# Altium project OMODRI.PrjPcb (part 4 of 5)

## Sheet OMODRI_EtherCAT_1.SchDoc
size A4
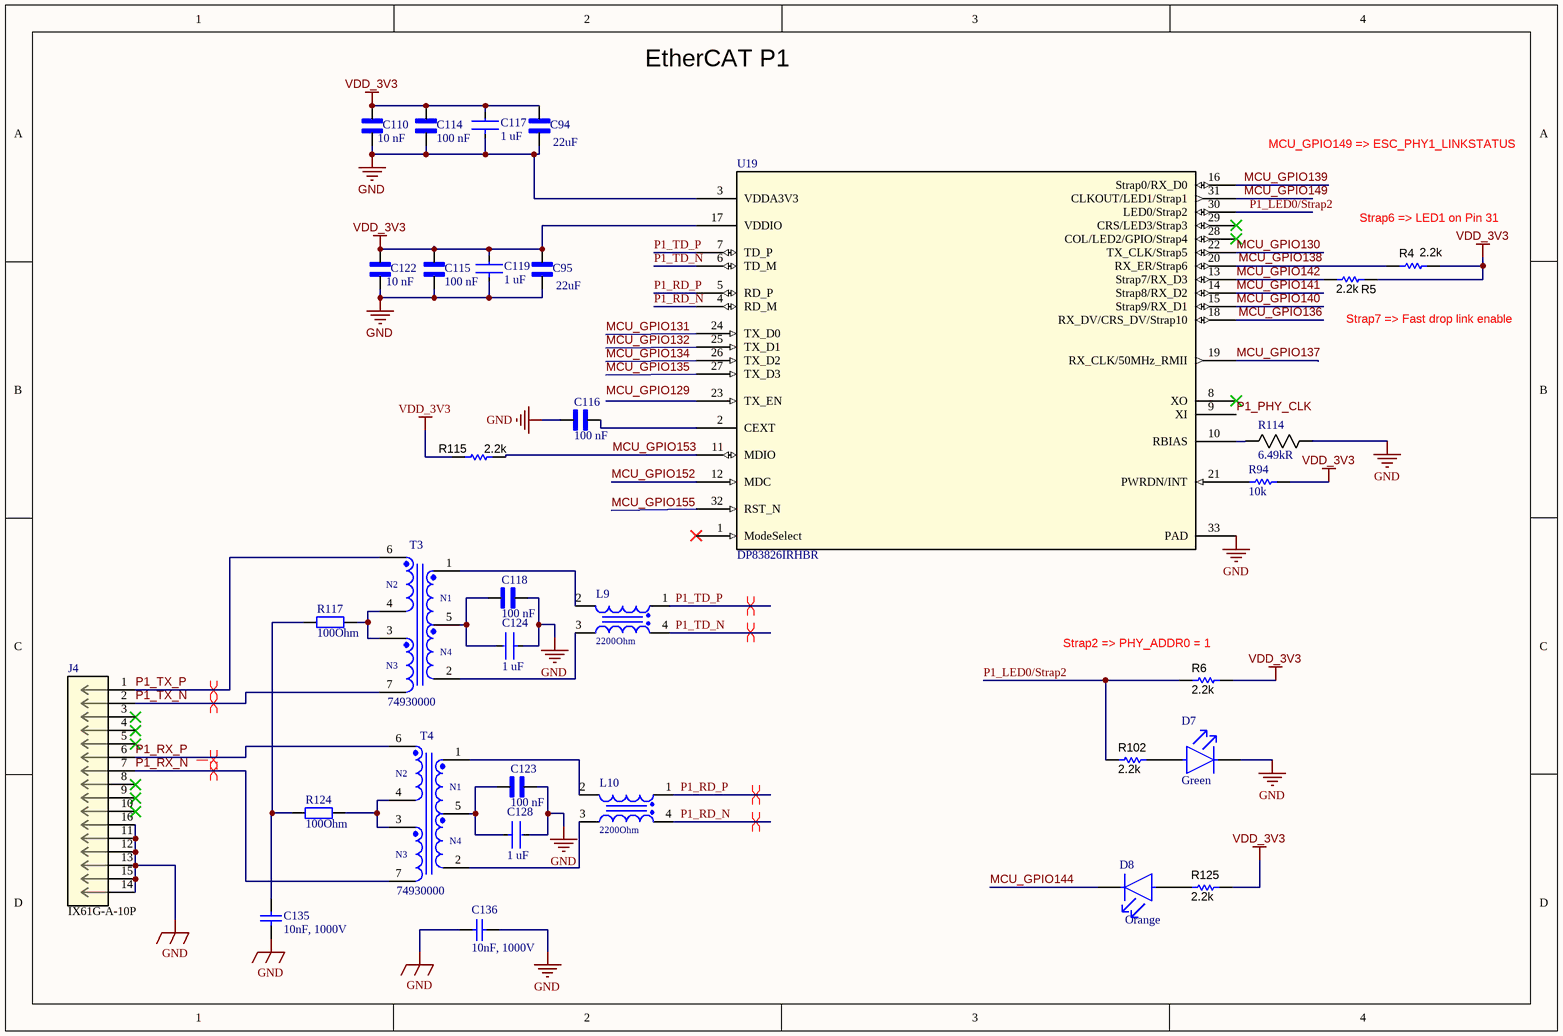
[diagram p6: OMODRI_EtherCAT_1.SchDoc]

### Parts
C94  value 22uF  [CAPC1005X55N]  (hidden comment: CL05A226MQ5N6J8)
C95  value 22uF  [CAPC1005X55N]  (hidden comment: CL05A226MQ5N6J8)
C110  value 10 nF  [CAPC0603X33N]  (hidden comment: GRM033R71E103KE14D)
C114  value 100 nF  [CAPC0603X33N]  (hidden comment: GRM033R61E104KE14D)
C115  value 100 nF  [CAPC0603X33N]  (hidden comment: GRM033R61E104KE14D)
C116  value 100 nF  [CAPC0603X33N]  (hidden comment: GRM033R61E104KE14D)
C117  value 1 uF  [FP-CC0201-BA-MFG]  (hidden comment: CC0201MRX5R5BB105)
C118  value 100 nF  [CAPC0603X33N]  (hidden comment: GRM033R61E104KE14D)
C119  value 1 uF  [FP-CC0201-BA-MFG]  (hidden comment: CC0201MRX5R5BB105)
C122  value 10 nF  [CAPC0603X33N]  (hidden comment: GRM033R71E103KE14D)
C123  value 100 nF  [CAPC0603X33N]  (hidden comment: GRM033R61E104KE14D)
C124  value 1 uF  [FP-CC0201-BA-MFG]  (hidden comment: CC0201MRX5R5BB105)
C128  value 1 uF  [FP-CC0201-BA-MFG]  (hidden comment: CC0201MRX5R5BB105)
C135  10nF, 1000V  [WCAP-CSMH_1206_H=1.25mm]
C136  10nF, 1000V  [WCAP-CSMH_1206_H=1.25mm]
D7  Illumination Color: Green  [ROHM-SML-P11MT_V]  (hidden comment: SML-P11MTT86R)
D8  Color: Orange  [ROHM-SML-P11MT_V]  (hidden comment: SML-P11DTT86R)
J4  Part Number: IX61G-A-10P  [CONN_1G-A-10P]  (value not drawn)
L9  2200Ohm  [WE-CNSW_1206]
L10  2200Ohm  [WE-CNSW_1206]
R4  ValueDisplayed: 2.2k  [0402]  (hidden comment: CRCW04022K20JNED)
R5  ValueDisplayed: 2.2k  [0402]  (hidden comment: CRCW04022K20JNED)
R6  ValueDisplayed: 2.2k  [0402]  (hidden comment: CRCW04022K20JNED)
R94  Resistance: 10k  [RESC1005X40X25LL05T05]  (hidden comment: ERJ2RKF1002X)
R102  ValueDisplayed: 2.2k  [0402]  (hidden comment: CRCW04022K20JNED)
R114  Resistance: 6.49kR  [RES_CRCW_0402]  (hidden comment: Part Number: CRCW04026K49FKED)
R115  ValueDisplayed: 2.2k  [0402]  (hidden comment: CRCW04022K20JNED)
R117  100Ohm  [WRIS-KWKB_0612_H=0.55mm]
R124  100Ohm  [WRIS-KWKB_0612_H=0.55mm]
R125  ValueDisplayed: 2.2k  [0402]  (hidden comment: CRCW04022K20JNED)
T3  74930000  [74930000]
T4  74930000  [74930000]
U19  DP83826IRHBR  [RHB0032B]

### Nets
GND: C94.1 C95.1 C110.1 C114.2 C115.2 C116.2 C117.1 C118.1 C119.1 C122.1 C123.1 C124.1 C128.2 C135.1 C136.1 C136.2 D7.1(C) J4.11 J4.12 J4.13 J4.14 J4.15 J4.16 R114.1 U19.3(VDDA3V3) U19.33(PAD)
VDD_3V3: C94.2 C95.2 C110.2 C114.1 C115.1 C117.2 C119.2 C122.2 R4.1 R5.1 R6.1 R94.1 R115.2 R125.1 U19.17(VDDIO)
MCU_GPIO130: U19.22(TX_CLK/Strap5)
MCU_GPIO131: U19.24(TX_D0)
MCU_GPIO132: U19.25(TX_D1)
MCU_GPIO134: U19.26(TX_D2)
MCU_GPIO135: U19.27(TX_D3)
MCU_GPIO136: U19.18(RX_DV/CRS_DV/Strap10)
MCU_GPIO137: U19.19(RX_CLK/50MHz_RMII)
MCU_GPIO138: R4.2 U19.20(RX_ER/Strap6)
MCU_GPIO139: U19.16(Strap0/RX_D0)
MCU_GPIO140: U19.15(Strap9/RX_D1)
MCU_GPIO141: U19.14(Strap8/RX_D2)
MCU_GPIO142: R5.2 U19.13(Strap7/RX_D3)
MCU_GPIO144: D8.1(C)
MCU_GPIO149: U19.31(CLKOUT/LED1/Strap1)
MCU_GPIO152: U19.12(MDC)
MCU_GPIO153: R115.1 U19.11(MDIO)
MCU_GPIO155: U19.32(RST_N)
P1_LED0/Strap2: R6.2 R102.1 U19.30(LED0/Strap2)
P1_PHY_CLK: U19.9(XI)
P1_RD_N: L10.4 U19.4(RD_M)
P1_RD_P: L10.1 U19.5(RD_P)
P1_RX_N: J4.7 T4.7
P1_RX_P: J4.6 T4.6
P1_TD_N: L9.4 U19.6(TD_M)
P1_TD_P: L9.1 U19.7(TD_P)
P1_TX_N: J4.2 T3.7
P1_TX_P: J4.1 T3.6
NetC116_1: C116.1 U19.2(CEXT)
NetC118_2: C118.2 C124.2 T3.5
NetC123_2: C123.2 C128.1 T4.5
NetC135_2: C135.2 R117.1 R124.1
NetD7_2: D7.2(A) R102.2
NetD8_2: D8.2(A) R125.2
NetL9_2: L9.2 T3.1
NetL9_3: L9.3 T3.2
NetL10_2: L10.2 T4.1
NetL10_3: L10.3 T4.2
NetR94_2: R94.2 U19.21(PWRDN/INT)
NetR114_2: R114.2 U19.10(RBIAS)
NetR117_2: R117.2 T3.3 T3.4
NetR124_2: R124.2 T4.3 T4.4

Not connected (* = marked no-connect by the designer): J4 3* 4* 5* 8* 9* 10*; U19 1(ModeSelect)* 8(XO)* 23(TX_EN) 28(COL/LED2/GPIO/Strap4)* 29(CRS/LED3/Strap3)*

### Layout directives
differential pair: (no net found under the mark), P1_RD_N, P1_RD_P, P1_RX_N, P1_TD_N, P1_TD_P, P1_TX_N, P1_TX_P

### Notes on the sheet
- EtherCAT P1
- MCU_GPIO149 => ESC_PHY1_LINKSTATUS
- Strap6 => LED1 on Pin 31
- Strap7 => Fast drop link enable
- (near R6) Strap2 => PHY_ADDR0 = 1
- Labels drawn without touching a wire or pin: MCU_GPIO129
- (in symbol 74930000) N2; N1; N4; N3

### Library data of the parts
C94 C95 = CL05A226MQ5N6J8: 22µF ±20% 6.3V Ceramic Capacitor X5R 0402 (1005 Metric); MF: Samsung Electro-Mechanics; Package: 0402 Samsung Electro-Mechanics; Availability: Unavailable; MP: CL05A226MQ5N6J8; DigiKey-Purchase-URL: https://snapeda.com/shop?store=DigiKey&id=3601912; SnapEDA_Link: https://www.snapeda.com/parts/CL05A226MQ5N6J8/Samsung%20Electro-Mechanics/view-part/3601912/?ref=snap; Price: None
C110 C122 = GRM033R71E103KE14D: SMD Capacitor X7R_EIA_ with Capacitance: 10000pF Tol. 10%. Rated Voltage: 25Vdc; MF: Murata; SnapEDA_Link: https://www.snapeda.com/parts/GRM033R71E103KE14D/Murata/view-part/4379447/?ref=snap; Package: 0603 Taiyo Yuden; MP: GRM033R71E103KE14D; Digi-Key_Purchase_URL: https://www.digikey.com/product-detail/en/murata-electronics/GRM033R71E103KE14D/490-14454-1-ND/6606915?utm_source=snapeda&utm_medium=aggregator&utm_campaign=symbol; Digi-Key_Part_Number: 490-14454-1-ND
C114-C116 C118 C123 = GRM033R61E104KE14D: SMD Capacitor X5R_EIA_ with Capacitance: 0.10uF Tol. 10%. Rated Voltage: 25Vdc; MF: Murata; SnapEDA_Link: https://www.snapeda.com/parts/GRM033R61E104KE14D/Murata/view-part/4375622/?ref=snap; Availability: Unavailable; MP: GRM033R61E104KE14D; Package: 0603 Taiyo Yuden; Price: None
C117 C119 C124 C128 = CMP-03422-000660-1: CAP CER 1UF 6.3V X5R 0201; Manufacturer: Yageo; Material: Ceramic; Tolerance: 0.2; Temperature Coefficient: 15%; Lead Free: Yes; Capacitance: 1 uF; ComponentLink2URL: http://www.yageo.com/documents/recent/UPY-GPHC_X5R_4V-to-50V_25.pdf; Footprint Url: http://www.yageo.com/exep/pages/download/literatures/UPY-C_GEN_24.pdf; Temperature Range Low: -55°C; Category: Cap; Device Class L3: Ceramic Capacitors; Device Class L2: Capacitors; Digikey Description: CAP CER 1UF 6.3V X5R 0201; Automotive: No; Temperature: -55°C to +85°C; RoHS: TRUE; Octopart: https://octopart.com/cc0201mrx5r5bb105-yageo-33242268; Height: 0.33mm; Temperature Range High: +85°C; Temperature Characteristic: X5R; Device Class L1: Passive Components; Package: CC0201-BA; ComponentLink2Description: Datasheet; Manufacturer Part Number: CC0201MRX5R5BB105; Voltage Rating: 6.3 V; Mouser Description: Multilayer Ceramic Capacitors MLCC - SMD/SMT 1.0uF 6.3V X5R 20%; Ipc Land Pattern Name: CAPC6030X30
C135 C136 = 885342208021: WCAP-CSMH Ceramic Capacitors, size 1206, 10nF, 1000VDC; Ceramic Type: X7R Class II; Dissipation Factor: 2.5%; Insulation Resistance: 10GOhm; Technical Reference: X7R1206103KA00DFCT10000; ComponentLink1Description: Manufacturer; ComponentLink1URL: http://www.we-online.de; ComponentLink2Description: Datasheet; ComponentLink2URL: https://katalog.we-online.com/pbs/datasheet/885342208021.pdf; Packaging: Tape and Reel; Part Number: 885342208021; Published Date: August 2019; Rated Voltage: 1000VDC; Size: 1206; Mounting Technology: SMD; Publisher: Wurth Elektronik; Capacitance: 10nF; Operating Temperature: -55 to +125degC
D7 = SML-P11MTT86R: LED Uni-Color Yellow Green 2-Pin Chip 0402(1006Metric) T/R; Manufacturer: Rohm; Lens Color: Colorless,Clear; Lens Style: Diffused,Colorless,Rectangular,Square,Clear; Number of LEDs: 1; Luminous Intensity: 2.1mcd; Forward Voltage: 1.9V; Wavelength: 569nm; Forward Current: 20mA; Test Current: 1mA; Lens Transparency: Clear; Viewing Angle: 150°; Power Rating: 54mW; Color: Green,Yellow; Supplier 1: Digi-Key; Manufacturer Part Number: SML-P11MTT86; RoHS: Yes; Category: LEDs; Stock 1: 6550; Pricing 1: 1=0,39000, 10=0,27200, 100=0,15890, 500=0,10896, 1000=0,09080, 2500=0,08172, 5000=0,07718 (USD); Mount: Surface Mount; Case/Package: 0402; Number of Pins: 2; Case Code (Imperial): 0402; Case Code (Metric): 1005; Min Operating Temperature: -40°C; Max Operating Temperature: 85°C; Packaging: Tape and Reel; Dominant Wavelength: 569nm; Package Quantity: 1; Length: 1mm; Height: 0.25mm; Width: 0.6mm; Radiation Hardening: No; REACH SVHC: No SVHC; Lead Free: Lead Free; ComponentLink1URL: https://datasheet.ciiva.com/5685/1738942-5685465.pdf?src-supplier=Farnell; ComponentLink1Description: https://datasheet.ciiva.com/5685/1738942-5685465.pdf?src-supplier=Farnell; ComponentLink2URL: https://datasheet.ciiva.com/11773/0900766b80df3ad7-11773737.pdf?src-supplier=RSComponents; ComponentLink2Description: https://datasheet.ciiva.com/11773/0900766b80df3ad7-11773737.pdf?src-supplier=RSComponents; ComponentLink3URL: https://datasheet.ciiva.com/16201/sml-p11mtt86-16201197.pdf?src-supplier=Future+Electronics; ComponentLink3Description: https://datasheet.ciiva.com/16201/sml-p11mtt86-16201197.pdf?src-supplier=Future+Electronics; ComponentLink4URL: https://datasheet.ciiva.com/2114/sml-p11-p-eco-2114983.pdf?src-supplier=Digi-Key; ComponentLink4Description: https://datasheet.ciiva.com/2114/sml-p11-p-eco-2114983.pdf?src-supplier=Digi-Key; ComponentLink5URL: https://datasheet.ciiva.com/2114/sml-p11-p-eco-2114984.pdf?src-supplier=Digi-Key; ComponentLink5Description: https://datasheet.ciiva.com/2114/sml-p11-p-eco-2114984.pdf?src-supplier=Digi-Key; ComponentLink6URL: https://datasheet.ciiva.com/2114/sml-p11-p-eco-2114985.pdf?src-supplier=Digi-Key; ComponentLink6Description: https://datasheet.ciiva.com/2114/sml-p11-p-eco-2114985.pdf?src-supplier=Digi-Key; ComponentLink7URL: https://datasheet.ciiva.com/4689/sml-p1-471200-4689502.pdf?src-supplier=Mouser; ComponentLink7Description: https://datasheet.ciiva.com/4689/sml-p1-471200-4689502.pdf?src-supplier=Mouser; ComponentLink8URL: https://datasheet.ciiva.com/29281/157928-da-01-en-led-0402-gelb-gruen-sml-p11mt-t86-29281338.pdf?src-supplier=Conrad; ComponentLink8Description: https://datasheet.ciiva.com/29281/157928-da-01-en-led-0402-gelb-gruen-sml-p11mt-t86-29281338.pdf?src-supplier=Conrad; Supplier Part Number 1: 511-1652-1-ND
D8 = SML-P11DTT86R: LED ORANGE CLEAR 1006 SMD; Manufacturer: Rohm; Lens Color: Colorless; Luminous Intensity: 7.3mcd; Test Current: 1mA; Dominant Wavelength: 605nm; Forward Voltage: 1.9V; Lens Style: Square,Diffused,Colorless; Number of LEDs: 1; Supplier 1: Digi-Key; Manufacturer Part Number: SML-P11DTT86R; RoHS: Yes; Category: LEDs; Stock 1: 2306; Pricing 1: 1=0,48000, 10=0,34300, 100=0,22400, 500=0,16100, 1000=0,12600, 2500=0,11550 (USD); Mount: Surface Mount; Case/Package: SMD/SMT; Number of Pins: 2; Lens Transparency: Clear; Forward Current: 1mA; Wavelength: 605nm; Packaging: Tape and Reel; Length: 1mm; Height: 0.25mm; Width: 0.6mm; REACH SVHC: Unknown; Lead Free: Lead Free; ComponentLink1URL: https://datasheet.ciiva.com/48679/sml-p11-p-eco-48679066.pdf?src-supplier=Avnet; ComponentLink1Description: https://datasheet.ciiva.com/48679/sml-p11-p-eco-48679066.pdf?src-supplier=Avnet; Supplier Part Number 1: SML-P11DTT86RCT-ND
J4 = IX61G-A-10P: Conn Ethernet Connector RCP 10 POS Solder RA Thru-Hole 10 Terminal 1 Port Cat 5e/Cat 6a Reel; Vendor: Hirose; Built_By: EMA_Matt; SourceLibrary: Hirose_12_20_2019; Connector Type: Receptacle; Number of Positions: 10; Manufacturer_Part_Number: IX61G-A-10P; Copyright: Copyright (C) 2018 Accelerated Designs. All rights reserved; RefDes: RefDes; Type: DEV; Value: Value; Supplier 1: Digi-Key; Manufacturer: Hirose; Manufacturer Part Number: IX61G-A-10P; RoHS: No; Category: Connectors; Stock 1: 3441; Pricing 1: 1=3,52000, 10=3,37900, 25=3,09760, 50=2,95680, 100=2,81600 (USD); Mount: Surface Mount; Contact Plating: Gold; Packaging: Tape and Reel; Termination: Solder; ComponentLink1URL: http://www.farnell.com/datasheets/2691134.pdf?src-supplier=Farnell; ComponentLink1Description: http://www.farnell.com/datasheets/2691134.pdf?src-supplier=Farnell; ComponentLink2URL: https://www.hirose.com/product/download/?distributor=digikey&amp;type=2d&amp;lang=en&amp;num=IX61G-A-10P&src-supplier=Digi-Key; ComponentLink2Description: https://www.hirose.com/product/download/?distributor=digikey&amp;type=2d&amp;lang=en&amp;num=IX61G-A-10P&src-supplier=Digi-Key; Supplier Part Number 1: H125667CT-ND
L9 L10 = 744232222: WE-CNSW SMT Common Mode Line Filter, size 1206, 2200Ohm, 0.2A, 50V; Manufacturer: Wurth Elektronik; DC Resistance max.: 1.2Ohm; Impedance Test Condition: 100MHz; Insulation Test Voltage: 125VAC; Winding Style: bifiliar; ComponentLink1Description: Manufacturer; ComponentLink1URL: http://www.we-online.de; ComponentLink2Description: Datasheet; ComponentLink2URL: https://www.we-online.com/catalog/datasheet/744232222.pdf; Operating Temperature: -40 to +125degC; Packaging: Tape and Reel; Published Date: April 2020; Rated Current: 0.2A; Size: 1206; Impedance: 2200Ohm; Manufacturer Part Number: 744232222; Rated Voltage: 50V; Mounting Technology: SMT
R4-R6 R102 R115 R125 = CMP-0026890-5: RES, 2.2 k, 5%, 0.063 W, AEC-Q200 Grade 0, 0402; Manufacturer: Vishay-Dale; Power_W: 63mW; TempCo: 200 ppm/C; Value_Code: 2k20; Value: 2.2k; EIA_Code: E24; SizeX_mm: 1; SizeY_mm: 0.5; SizeZ_mm: 0.6; Value2: 0.063W; AEC Qualified: Y; VDC_V: 50V; AEC Category: Q200; AEC Grade: 0; Supplier Part Number 2: 59M6710; Supplier 2: Newark; Supplier Part Number 3: 71-CRCW0402J-2.2K-E3; Supplier 3: Mouser; RoHS: E; Value1: 5%; MountType: SMT; Supplier 1: Digi-Key; PackageReference: 0402; Tolerance_%: 5%; Res_ohm: 2.2k; SizeArea_mm2: 0.5; CompType: Resistor; PartNumber: CRCW04022K20JNED; ComponentLink1Description: Datasheet link; Supplier Part Number 1: 541-2.2KJCT-ND; Technology: Thick Film; ComponentLink1URL: http://www.vishay.com/docs/20035/dcrcwe3.pdf
R94 = CMP-2000-07588-1: Chip Resistor, 10 KOhm, +/- 1%, 0.1 W, -55 to 155 degC, 0402 (1005 Metric), RoHS, Tape and Reel; Manufacturer: Panasonic; Power Rating: 100mW; Voltage Rating: 50V; Case\/Package: 0402; Temperature Coefficient: 100ppm\/degreesC; RoHSCompliant: True; Lead Free: LeadFree; Package Quantity: 1; Contact Plating: Tin; Length: 1mm; Radiation Hardening: No; REACH SVHC: NoSVHC; Max Operating Temperature: 155degC; Depth: 0.5mm; Case Code (Imperial): 0402; Military Standard: Not; Package Description: 2-Pin Surface Mount Device, Body 1 x 0.5 mm; Termination: SMD/SMT; Case Code (Metric): 1005; Height: 0.35mm; Packaging: TapeandReel; Voltage Rating (DC): 50V; Package Reference: 402; Number of Pins: 2; Tolerance: 1%; Mounting Technology: SurfaceMount; Width: 0.02inch; Mount: SurfaceMount; Datasheet URL: https://industrial.panasonic.com/cdbs/www-data/pdf/RDA0000/AOA0000C304.pdf; Composition: ThickFilm; Datasheet Version: 02/2017; Manufacturer URL: http://www.panasonic.com/; Max Power Dissipation: 100mW; Number of Terminations: 2; Min Operating Temperature: -55degC
R114 = CRCW04026K49FKED: Res Thick Film 0402 6.49K Ohm 1% 0.063W(1/16W) ±100ppm/C Pad SMD Automotive T/R; Vendor: Vishay; Built_By: EMA_UL_Team; Temperature Coefficient: 100ppm/°C; Power Rating: 63mW; Voltage Rating: 50V; Manufacturer_Part_Number: CRCW04026K49FKED; Copyright: Copyright (C) 2018 Accelerated Designs. All rights reserved; RefDes: RefDes; Type: DEV; Value: Value; Supplier 1: Digi-Key; Manufacturer: Vishay; Manufacturer Part Number: CRCW04026K49FKED; RoHS: Yes; Category: Chip SMD Resistors; Stock 1: 24052; Pricing 1: 1=0,10000, 10=0,03600, 100=0,01460, 1000=0,00657, 2500=0,00570, 5000=0,00471 (USD); Mount: Surface Mount; Case/Package: 0402; Number of Pins: 2; Weight: 2.3E-05oz; Contact Plating: Tin; Case Code (Metric): 1005; Case Code (Imperial): 0402; Min Operating Temperature: -55°C; Max Operating Temperature: 155°C; Composition: Thick Film; Packaging: Tape and Reel; Package Quantity: 10; Number of Terminations: 2; Max Power Dissipation: 63mW; Voltage Rating (DC): 50V; Military Standard: Not; Termination: SMD/SMT; Features: Automotive AEC-Q200; Length: 1mm; Height: 0.35mm; Width: 0.02inch; Depth: 0.5mm; Radiation Hardening: No; Lead Free: Lead Free; REACH SVHC: Unknown; ComponentLink1URL: https://datasheet.ciiva.com/11818/0900766b80d98824-11818134.pdf?src-supplier=RSComponents; ComponentLink1Description: https://datasheet.ciiva.com/11818/0900766b80d98824-11818134.pdf?src-supplier=RSComponents; ComponentLink2URL: https://datasheet.ciiva.com/2463/dcrcwe3-2463233.pdf?src-supplier=Digi-Key; ComponentLink2Description: https://datasheet.ciiva.com/2463/dcrcwe3-2463233.pdf?src-supplier=Digi-Key; ComponentLink3URL: https://datasheet.ciiva.com/2463/dcrcwe3-2463234.pdf?src-supplier=Digi-Key; ComponentLink3Description: https://datasheet.ciiva.com/2463/dcrcwe3-2463234.pdf?src-supplier=Digi-Key; ComponentLink4URL: https://datasheet.ciiva.com/5551/dcrcwe3-109170-5551783.pdf?src-supplier=Mouser; ComponentLink4Description: https://datasheet.ciiva.com/5551/dcrcwe3-109170-5551783.pdf?src-supplier=Mouser; ComponentLink5URL: https://datasheet.ciiva.com/7679/1697337-7679082.pdf?src-supplier=Element14; ComponentLink5Description: https://datasheet.ciiva.com/7679/1697337-7679082.pdf?src-supplier=Element14; ComponentLink6URL: https://datasheet.ciiva.com/7679/1697337-7679258.pdf?src-supplier=Element14; ComponentLink6Description: https://datasheet.ciiva.com/7679/1697337-7679258.pdf?src-supplier=Element14; ComponentLink7URL: https://datasheet.ciiva.com/2463/dcrcwe3-2463232.pdf?src-supplier=Digi-Key; ComponentLink7Description: https://datasheet.ciiva.com/2463/dcrcwe3-2463232.pdf?src-supplier=Digi-Key; Supplier Part Number 1: 541-6.49KLCT-ND; Tolerance: 1%
R117 R124 = 561020132009: WRIS-KWKB Thick Film Resistors, size 0612, 100Ohm, +/-5%, 0.75W; Rated Current: 86.6mA; Temperature Coefficient of Resistance: +/-200ppm/degC; Technical Reference: KB06121000J304DAATP0000; ComponentLink1Description: Manufacturer; ComponentLink1URL: http://www.we-online.de; ComponentLink2Description: Datasheet; ComponentLink2URL: https://katalog.we-online.com/pbs/datasheet/561020132009.pdf; Publisher: Wurth Elektronik; Rated Power: 0.75W; Resistance: 100Ohm; Mounting Technology: SMT; Height: 0.55mm; Part Number: 561020132009; Packaging: Tape and Reel; Published Date: September 2019; Size: 0612; Length: 1.6mm; Operating Temperature: -55 to +155degC; Resistance Tolerance: +/-5%; Width: 3.2mm
T3 T4 = 74930000: WE-STST Super Tiny Signal Transformer, size 4532, 350uH; Insulation Test Voltage: 1500VRMS; Turns Ratio: 1:1; ComponentLink1Description: Manufacturer; ComponentLink1URL: http://www.we-online.de; ComponentLink2Description: Datasheet; ComponentLink2URL: https://katalog.we-online.com/pbs/datasheet/74930000.pdf; Packaging: Tape and Reel; Publisher: Wurth Elektronik; Size: 4532; Inductance: 350uH; Mounting Technology: SMT; Operating Temperature: -40 to +105degC; Part Number: 74930000; Published Date: November 2019
U19 = DP83826IRHBR: Low latency 10/100-Mbps PHY, MII interface and enhanced mode with an industrial temperature range 32-VQFN -40 to 85; Manufacturer: Texas Instruments; Supplier 1: Avnet; Manufacturer Part Number: DP83826IRHBR; Pricing 1: 3000=1,00750, 6000=0,96850, 12000=0,92300, 18000=0,89700, 24000=0,86450 (USD); ComponentLink1URL: https://octopart.com/click/track?ai=8629&ct=datasheets&sig=00cfb32&at=physicalpart&sid=370&ppid=108112645&hlid=29178382&src-supplier=TI+store; ComponentLink1Description: https://octopart.com/click/track?ai=8629&ct=datasheets&sig=00cfb32&at=physicalpart&sid=370&ppid=108112645&hlid=29178382&src-supplier=TI+store; Supplier Part Number 1: DP83826IRHBR

## Sheet OMODRI_Power.SchDoc
size A3; Date: Not shown in title block; ApprovedBy: Not shown in title block; CheckedBy: Not shown in title block; Author: Not shown in title block; CompanyName: Not shown in title block; DrawnBy: Cody Watkins; Engineer: Not shown in title block; Organization: Not shown in title block; Address1: Not shown in title block; Address2: Not shown in title block; Address3: Not shown in title block; Address4: Not shown in title block; DocumentNumber: 5; Revision: Use project parameter SCH_Rev; SheetNumber: 5; SheetTotal: 11; PageSetup: Record=PageOptions|CenterHorizontal=True|CenterVertical=True|PrintScale=1.00|XCorrection=1.00|YCorrection=1.00|PrintKind=0|BorderSize=5000000|LeftOffset=0|BottomOffset=0|Orientation=2|PaperLength=1000|PaperWidth=1000|Scale=100|PaperSource=15|PrintQuality=600|MediaType=1|DitherType=10|PaperKind=Letter|PrintScaleMode=1; CurrentTime: Not shown in title block; CurrentDate: Not shown in title block; Time: Not shown in title block; DocumentFullPathAndName: Not shown in title block; DocumentName: Not shown in title block; ModifiedDate: Not shown in title block; ImagePath: Not shown in title block
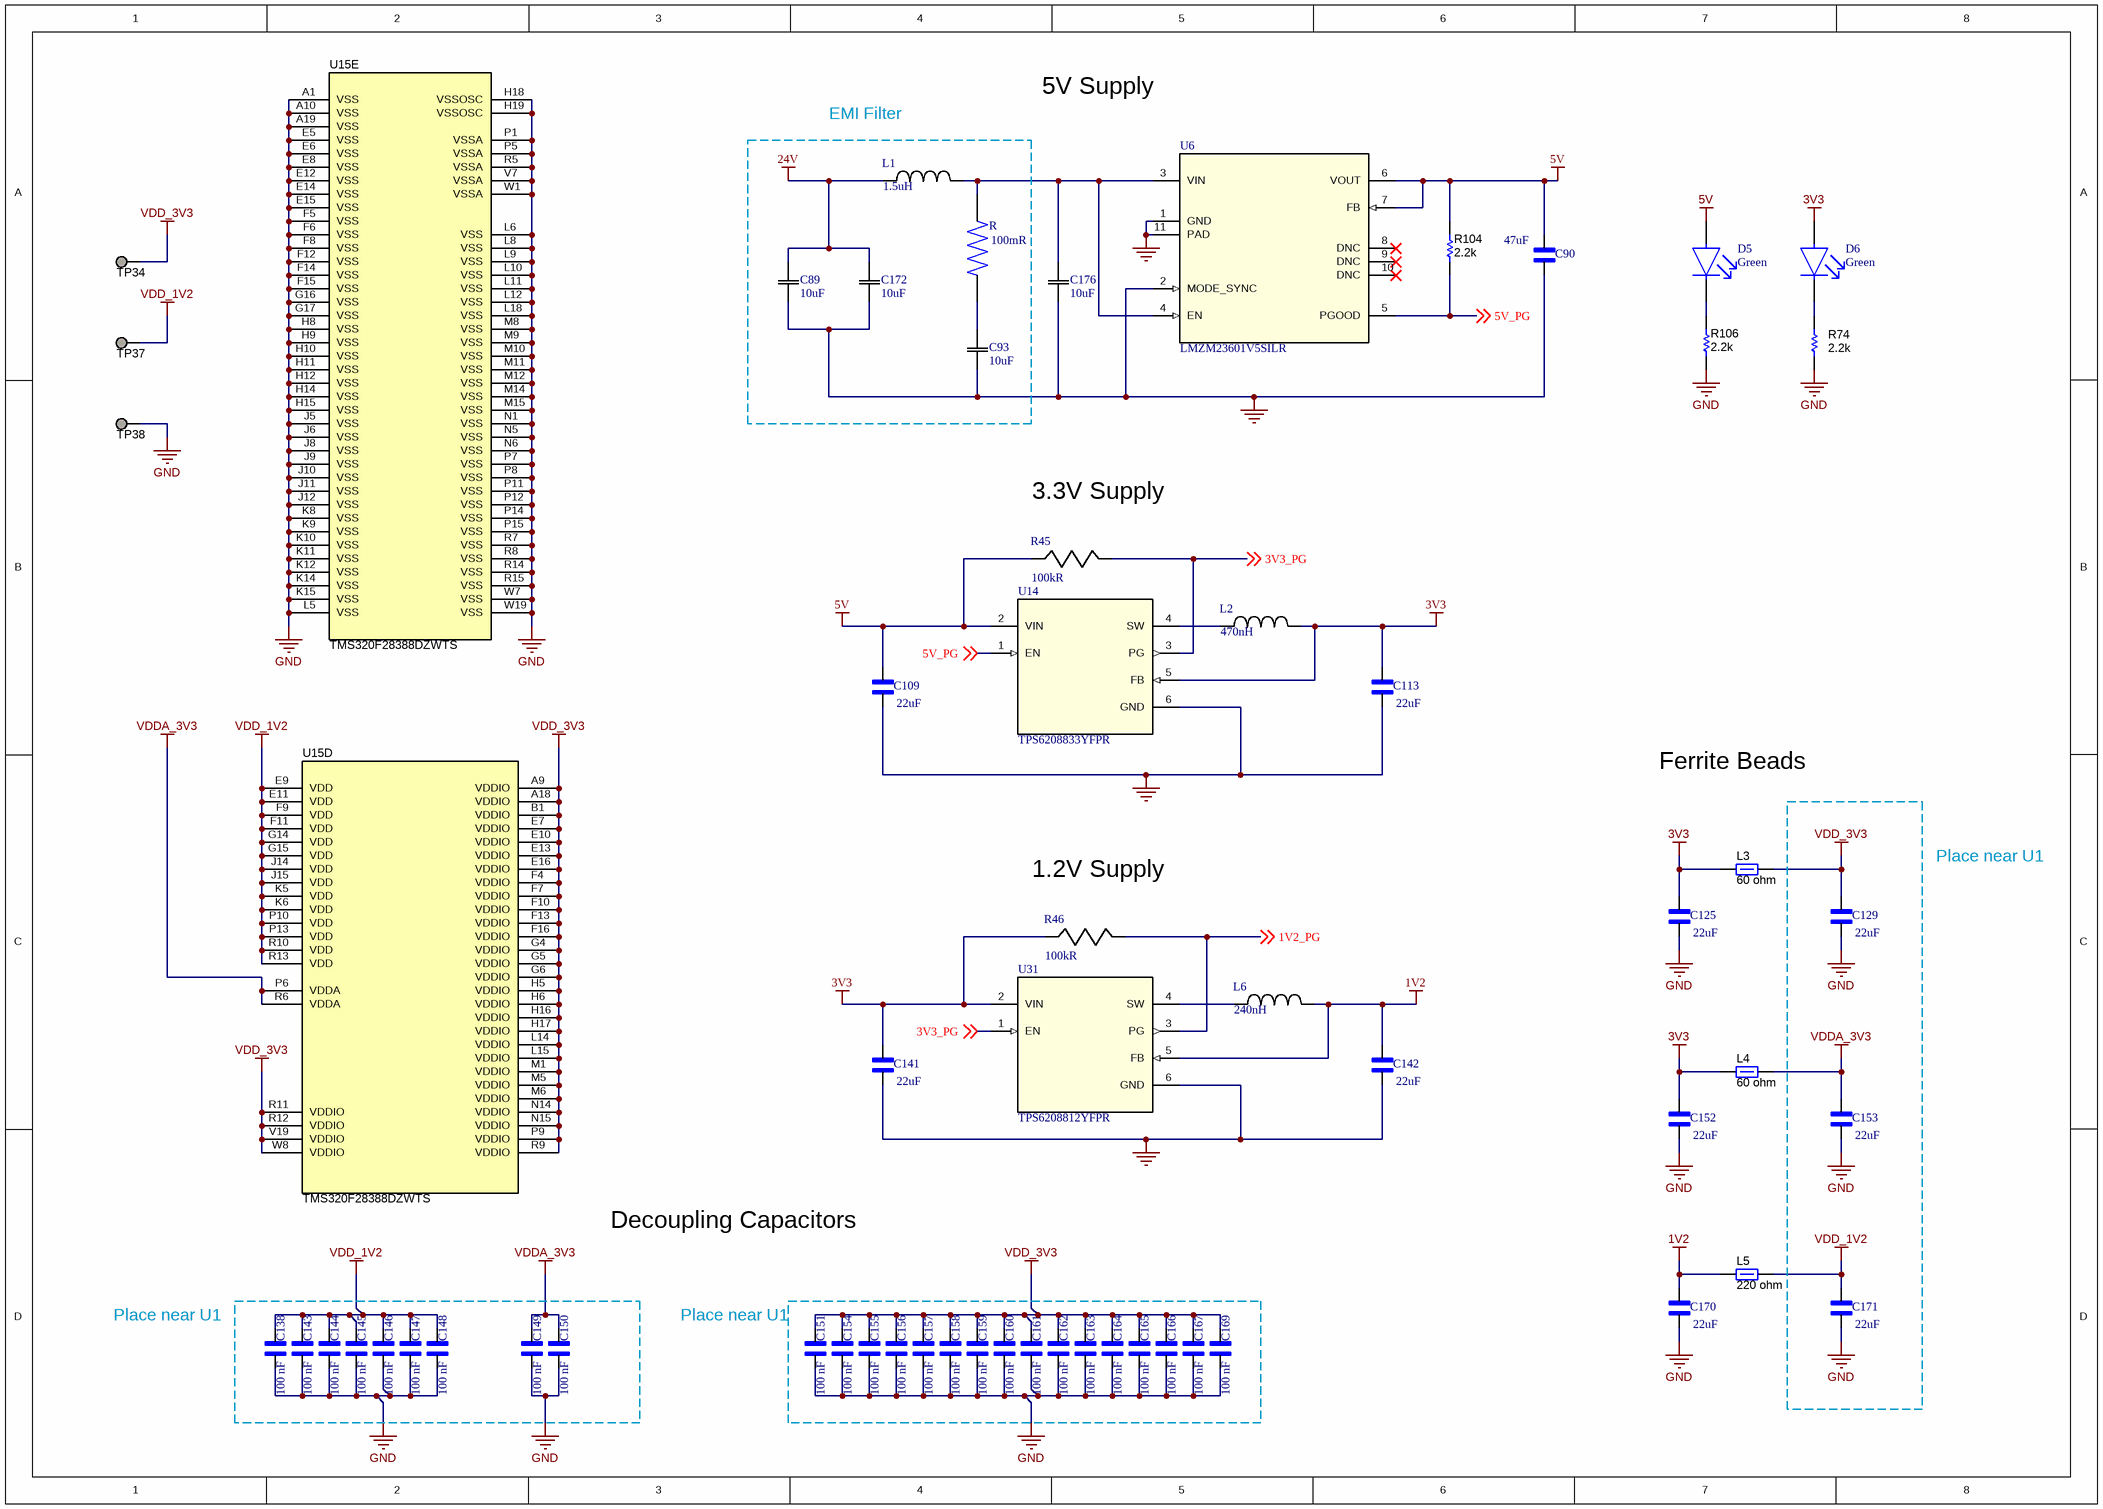
[diagram p7: OMODRI_Power.SchDoc]

### Parts
C89  Capacitance: 10uF  [CAP_CL10]  (hidden comment: Part Number: CL10A106MA8NRNC)
C90  value 47uF  [CAPC2012X145N]  (hidden comment: C2012X5R1A476M125AC)
C93  Capacitance: 10uF  [CAP_CL10]  (hidden comment: Part Number: CL10A106MA8NRNC)
C109  value 22uF  [CAPC1005X55N]  (hidden comment: CL05A226MQ5N6J8)
C113  value 22uF  [CAPC1005X55N]  (hidden comment: CL05A226MQ5N6J8)
C125  value 22uF  [CAPC1005X55N]  (hidden comment: CL05A226MQ5N6J8)
C129  value 22uF  [CAPC1005X55N]  (hidden comment: CL05A226MQ5N6J8)
C138  value 100 nF  [CAPC0603X33N]  (hidden comment: GRM033R61E104KE14D)
C141  value 22uF  [CAPC1005X55N]  (hidden comment: CL05A226MQ5N6J8)
C142  value 22uF  [CAPC1005X55N]  (hidden comment: CL05A226MQ5N6J8)
C143  value 100 nF  [CAPC0603X33N]  (hidden comment: GRM033R61E104KE14D)
C144  value 100 nF  [CAPC0603X33N]  (hidden comment: GRM033R61E104KE14D)
C145  value 100 nF  [CAPC0603X33N]  (hidden comment: GRM033R61E104KE14D)
C146  value 100 nF  [CAPC0603X33N]  (hidden comment: GRM033R61E104KE14D)
C147  value 100 nF  [CAPC0603X33N]  (hidden comment: GRM033R61E104KE14D)
C148  value 100 nF  [CAPC0603X33N]  (hidden comment: GRM033R61E104KE14D)
C149  value 100 nF  [CAPC0603X33N]  (hidden comment: GRM033R61E104KE14D)
C150  value 100 nF  [CAPC0603X33N]  (hidden comment: GRM033R61E104KE14D)
C151  value 100 nF  [CAPC0603X33N]  (hidden comment: GRM033R61E104KE14D)
C152  value 22uF  [CAPC1005X55N]  (hidden comment: CL05A226MQ5N6J8)
C153  value 22uF  [CAPC1005X55N]  (hidden comment: CL05A226MQ5N6J8)
C154  value 100 nF  [CAPC0603X33N]  (hidden comment: GRM033R61E104KE14D)
C155  value 100 nF  [CAPC0603X33N]  (hidden comment: GRM033R61E104KE14D)
C156  value 100 nF  [CAPC0603X33N]  (hidden comment: GRM033R61E104KE14D)
C157  value 100 nF  [CAPC0603X33N]  (hidden comment: GRM033R61E104KE14D)
C158  value 100 nF  [CAPC0603X33N]  (hidden comment: GRM033R61E104KE14D)
C159  value 100 nF  [CAPC0603X33N]  (hidden comment: GRM033R61E104KE14D)
C160  value 100 nF  [CAPC0603X33N]  (hidden comment: GRM033R61E104KE14D)
C161  value 100 nF  [CAPC0603X33N]  (hidden comment: GRM033R61E104KE14D)
C162  value 100 nF  [CAPC0603X33N]  (hidden comment: GRM033R61E104KE14D)
C163  value 100 nF  [CAPC0603X33N]  (hidden comment: GRM033R61E104KE14D)
C164  value 100 nF  [CAPC0603X33N]  (hidden comment: GRM033R61E104KE14D)
C165  value 100 nF  [CAPC0603X33N]  (hidden comment: GRM033R61E104KE14D)
C166  value 100 nF  [CAPC0603X33N]  (hidden comment: GRM033R61E104KE14D)
C167  value 100 nF  [CAPC0603X33N]  (hidden comment: GRM033R61E104KE14D)
C169  value 100 nF  [CAPC0603X33N]  (hidden comment: GRM033R61E104KE14D)
C170  value 22uF  [CAPC1005X55N]  (hidden comment: CL05A226MQ5N6J8)
C171  value 22uF  [CAPC1005X55N]  (hidden comment: CL05A226MQ5N6J8)
C172  Capacitance: 10uF  [CAP_CL10]  (hidden comment: Part Number: CL10A106MA8NRNC)
C176  Capacitance: 10uF  [CAP_CL10]  (hidden comment: Part Number: CL10A106MA8NRNC)
D5  Illumination Color: Green  [ROHM-SML-P11MT_V]  (hidden comment: SML-P11MTT86R)
D6  Illumination Color: Green  [ROHM-SML-P11MT_V]  (hidden comment: SML-P11MTT86R)
L1  Inductance: 1.5uH  [0805]  (hidden comment: LQM21PN1R5MC0D)
L2  Inductance: 470nH  [0603]  (hidden comment: DFE18SANR47MG0L)
L3  value 60 ohm  [0805_HV]  (hidden comment: BKP2125HS600-T)
L4  value 60 ohm  [0805_HV]  (hidden comment: BKP2125HS600-T)
L5  value 220 ohm  [0805_HV]  (hidden comment: BLM21PG221SN1D)
L6  Inductance: 240nH  [DFE18_E]  (hidden comment: DFE18SANR24ME0L)
R  value 100mR  [RESC0603X29N]  (hidden comment: UCR006YVPFLR100)
R45  Resistance: 100kR  [0402]  (hidden comment: CRCW0402100KFKED)
R46  Resistance: 100kR  [0402]  (hidden comment: CRCW0402100KFKED)
R74  ValueDisplayed: 2.2k  [0402]  (hidden comment: CRCW04022K20JNED)
R104  ValueDisplayed: 2.2k  [0402]  (hidden comment: CRCW04022K20JNED)
R106  ValueDisplayed: 2.2k  [0402]  (hidden comment: CRCW04022K20JNED)
TP34  TESTPOINT  [TP_50MIL-25MILHOLE]  (value not drawn)  (no BOM)
TP37  TESTPOINT  [TP_50MIL-25MILHOLE]  (value not drawn)  (no BOM)
TP38  TESTPOINT  [TP_50MIL-25MILHOLE]  (value not drawn)  (no BOM)
U6  LMZM23601V5SILR  [SIL0010A]
U14  TPS6208833YFPR  [YFP0006AAAA]
U15  TMS320F28388DZWTS  [ZWT0337A]  (parts D,E of 5)
U31  TPS6208812YFPR  [YFP0006AAAA]

### Nets
0: C89.1 C90.1 C93.1 C109.1 C113.1 C141.1 C142.1 C172.1 C176.1 U6.1(GND) U6.2(MODE_SYNC) U6.11(PAD) U14.6(GND) U31.6(GND)
1V2: C142.2 C170.2 L5.1 L6.1 U31.5(FB)
3V3: C113.2 C125.2 C141.2 C152.2 D6.2(A) L2.1 L3.1 L4.1 R46.2 U14.5(FB) U31.2(VIN)
5V: C90.2 C109.2 D5.2(A) R45.2 R104.1 U6.6(VOUT) U6.7(FB) U14.2(VIN)
24V: C89.2 C172.2 L1.1
GND: C125.1 C129.1 C138.2 C143.2 C144.2 C145.2 C146.2 C147.2 C148.2 C149.2 C150.2 C151.2 C152.1 C153.1 C154.2 C155.2 C156.2 C157.2 C158.2 C159.2 C160.2 C161.2 C162.2 C163.2 C164.2 C165.2 C166.2 C167.2 C169.2 C170.1 C171.1 R74.1 R106.2 TP38.1 U15.A1(VSS) U15.A10(VSS) U15.A19(VSS) U15.E5(VSS) U15.E6(VSS) U15.E8(VSS) U15.E12(VSS) U15.E14(VSS) U15.E15(VSS) U15.F5(VSS) U15.F6(VSS) U15.F8(VSS) U15.F12(VSS) U15.F14(VSS) U15.F15(VSS) U15.G16(VSS) U15.G17(VSS) U15.H8(VSS) U15.H9(VSS) U15.H10(VSS) U15.H11(VSS) U15.H12(VSS) U15.H14(VSS) U15.H15(VSS) U15.H18(VSSOSC) U15.H19(VSSOSC) U15.J5(VSS) U15.J6(VSS) U15.J8(VSS) U15.J9(VSS) U15.J10(VSS) U15.J11(VSS) U15.J12(VSS) U15.K8(VSS) U15.K9(VSS) U15.K10(VSS) U15.K11(VSS) U15.K12(VSS) U15.K14(VSS) U15.K15(VSS) U15.L5(VSS) U15.L6(VSS) U15.L8(VSS) U15.L9(VSS) U15.L10(VSS) U15.L11(VSS) U15.L12(VSS) U15.L18(VSS) U15.M8(VSS) U15.M9(VSS) U15.M10(VSS) U15.M11(VSS) U15.M12(VSS) U15.M14(VSS) U15.M15(VSS) U15.N1(VSS) U15.N5(VSS) U15.N6(VSS) U15.P1(VSSA) U15.P5(VSSA) U15.P7(VSS) U15.P8(VSS) U15.P11(VSS) U15.P12(VSS) U15.P14(VSS) U15.P15(VSS) U15.R5(VSSA) U15.R7(VSS) U15.R8(VSS) U15.R14(VSS) U15.R15(VSS) U15.V7(VSSA) U15.W1(VSSA) U15.W7(VSS) U15.W19(VSS)
VDD_1V2: C138.1 C143.1 C144.1 C145.1 C146.1 C147.1 C148.1 C171.2 L5.2 TP37.1 U15.E9(VDD) U15.E11(VDD) U15.F9(VDD) U15.F11(VDD) U15.G14(VDD) U15.G15(VDD) U15.J14(VDD) U15.J15(VDD) U15.K5(VDD) U15.K6(VDD) U15.P10(VDD) U15.P13(VDD) U15.R10(VDD) U15.R13(VDD)
VDD_3V3: C129.2 C151.1 C154.1 C155.1 C156.1 C157.1 C158.1 C159.1 C160.1 C161.1 C162.1 C163.1 C164.1 C165.1 C166.1 C167.1 C169.1 L3.2 TP34.1 U15.A9(VDDIO) U15.A18(VDDIO) U15.B1(VDDIO) U15.E7(VDDIO) U15.E10(VDDIO) U15.E13(VDDIO) U15.E16(VDDIO) U15.F4(VDDIO) U15.F7(VDDIO) U15.F10(VDDIO) U15.F13(VDDIO) U15.F16(VDDIO) U15.G4(VDDIO) U15.G5(VDDIO) U15.G6(VDDIO) U15.H5(VDDIO) U15.H6(VDDIO) U15.H16(VDDIO) U15.H17(VDDIO) U15.L14(VDDIO) U15.L15(VDDIO) U15.M1(VDDIO) U15.M5(VDDIO) U15.M6(VDDIO) U15.N14(VDDIO) U15.N15(VDDIO) U15.P9(VDDIO) U15.R9(VDDIO) U15.R11(VDDIO) U15.R12(VDDIO) U15.V19(VDDIO) U15.W8(VDDIO)
VDDA_3V3: C149.1 C150.1 C153.2 L4.2 U15.P6(VDDA) U15.R6(VDDA)
1V2_PG: R46.1 U31.3(PG) ; off-sheet 1V2_PG  [project net MCU_XRSn]
3V3_PG: R45.1 U14.3(PG) U31.1(EN) ; off-sheet 3V3_PG
5V_PG: R104.2 U6.5(PGOOD) U14.1(EN) ; off-sheet 5V_PG
NetC93_2: C93.2 R.1
NetC176_2: C176.2 L1.2 R.2 U6.3(VIN) U6.4(EN)
NetD5_1: D5.1(C) R106.1
NetD6_1: D6.1(C) R74.2
NetL2_2: L2.2 U14.4(SW)
NetL6_2: L6.2 U31.4(SW)

Not connected (* = marked no-connect by the designer): U6 8(DNC)* 9(DNC)* 10(DNC)*

### Notes on the sheet
- EMI Filter
- 5V Supply
- 3.3V Supply
- Ferrite Beads
- Place near U1
- 1.2V Supply
- Decoupling Capacitors
- (near C151) Place near U1
- Drawn By:
- SVN Rev:
- Number:
- TID #:
- Orderable:
- Rev:
- Sheet Title:
- File:
- Project Title:
- Designed for:
- Assembly Variant:
- Mod. Date:
- Sheet:
- Size:
- of
- B
- http://www.ti.com
- Texas Instruments and/or its licensors do not warrant the accuracy or completeness of this specification or any information contained therein. Texas Instruments and/or its licensors do not warrant that this design will meet the specifications, will be suitable for your application or fit for any particular purpose, or will operate in an implementation. Texas Instruments and/or its licensors do not warrant that the design is production worthy. You should completely validate and test your design implementation to confirm the system functionality for your application.
- Engineer:
- Contact:
- © Texas Instruments

### Library data of the parts
C89 C93 C172 C176 = CL10A106MA8NRNC: CAP CER 10UF 25V X5R 0603; Vendor: Samsung; Built_By: EMA_Rocco; Type: DEV; Tolerance: 20%; Manufacturer_Part_Number: CL10A106MA8NRNC; Copyright: Copyright (C) 2018 Accelerated Designs. All rights reserved; RefDes: RefDes; Value: Value; Supplier 1: Digi-Key; Manufacturer: Samsung; Manufacturer Part Number: CL10A106MA8NRNC; RoHS: Yes; Category: Ceramic Capacitors; Stock 1: 30323; Pricing 1: 1=0,36000, 10=0,24900, 100=0,14120, 500=0,09966, 1000=0,08720 (USD); Mount: Surface Mount; Case/Package: 0603; Case Code (Imperial): 0603; Contact Plating: Tin; Case Code (Metric): 1608; Min Operating Temperature: -55°C; Max Operating Temperature: 85°C; Dielectric: X5R; Termination: Wraparound; Package Quantity: 1; Packaging: Tape and Reel; Voltage Rating: 25V; Length: 0.063inch; Thickness: 0.035inch; Width: 0.031inch; Lead Free: Lead Free; ComponentLink1URL: https://datasheet.ciiva.com/25766/cl10a106ma8nrnc-25766562.pdf?src-supplier=Digi-Key; ComponentLink1Description: https://datasheet.ciiva.com/25766/cl10a106ma8nrnc-25766562.pdf?src-supplier=Digi-Key
C90 = C2012X5R1A476M125AC: 47µF ±20% 10V Ceramic Capacitor X5R 0805 _2012 Metric_; MF: TDK; SnapEDA_Link: https://www.snapeda.com/parts/C2012X5R1A476M125AC/TDK-Lambda%20Americas%20Inc/view-part/78670/?ref=snap; Availability: Unavailable; Price: None; MP: C2012X5R1A476M125AC; Package: 2012 TDK
C109 C113 C125 C129 C141 C142 C152 C153 C170 C171 = CL05A226MQ5N6J8: as C94 on sheet OMODRI_EtherCAT_1; Package: 0402 Samsung Electro-Mechanics; Availability: Unavailable; MP: CL05A226MQ5N6J8; DigiKey-Purchase-URL: https://snapeda.com/shop?store=DigiKey&id=3601912; SnapEDA_Link: https://www.snapeda.com/parts/CL05A226MQ5N6J8/Samsung%20Electro-Mechanics/view-part/3601912/?ref=snap; Price: None
C138 C143-C151 C154-C167 C169 = GRM033R61E104KE14D: as C114-C116 on sheet OMODRI_EtherCAT_1; SnapEDA_Link: https://www.snapeda.com/parts/GRM033R61E104KE14D/Murata/view-part/4375622/?ref=snap; Availability: Unavailable; MP: GRM033R61E104KE14D; Package: 0603 Taiyo Yuden; Price: None
D5 D6 = SML-P11MTT86R: as D7 on sheet OMODRI_EtherCAT_1; Supplier 1: Digi-Key; Manufacturer Part Number: SML-P11MTT86; RoHS: Yes; Category: LEDs; Stock 1: 6550; Pricing 1: 1=0,39000, 10=0,27200, 100=0,15890, 500=0,10896, 1000=0,09080, 2500=0,08172, 5000=0,07718 (USD); Mount: Surface Mount; Case/Package: 0402; Number of Pins: 2; Case Code (Imperial): 0402; Case Code (Metric): 1005; Min Operating Temperature: -40°C; Max Operating Temperature: 85°C; Packaging: Tape and Reel; Dominant Wavelength: 569nm; Package Quantity: 1; Length: 1mm; Height: 0.25mm; Width: 0.6mm; Radiation Hardening: No; REACH SVHC: No SVHC; Lead Free: Lead Free; ComponentLink1URL: https://datasheet.ciiva.com/5685/1738942-5685465.pdf?src-supplier=Farnell; ComponentLink1Description: https://datasheet.ciiva.com/5685/1738942-5685465.pdf?src-supplier=Farnell; ComponentLink2URL: https://datasheet.ciiva.com/11773/0900766b80df3ad7-11773737.pdf?src-supplier=RSComponents; ComponentLink2Description: https://datasheet.ciiva.com/11773/0900766b80df3ad7-11773737.pdf?src-supplier=RSComponents; ComponentLink3URL: https://datasheet.ciiva.com/16201/sml-p11mtt86-16201197.pdf?src-supplier=Future+Electronics; ComponentLink3Description: https://datasheet.ciiva.com/16201/sml-p11mtt86-16201197.pdf?src-supplier=Future+Electronics; ComponentLink4URL: https://datasheet.ciiva.com/2114/sml-p11-p-eco-2114983.pdf?src-supplier=Digi-Key; ComponentLink4Description: https://datasheet.ciiva.com/2114/sml-p11-p-eco-2114983.pdf?src-supplier=Digi-Key; ComponentLink5URL: https://datasheet.ciiva.com/2114/sml-p11-p-eco-2114984.pdf?src-supplier=Digi-Key; ComponentLink5Description: https://datasheet.ciiva.com/2114/sml-p11-p-eco-2114984.pdf?src-supplier=Digi-Key; ComponentLink6URL: https://datasheet.ciiva.com/2114/sml-p11-p-eco-2114985.pdf?src-supplier=Digi-Key; ComponentLink6Description: https://datasheet.ciiva.com/2114/sml-p11-p-eco-2114985.pdf?src-supplier=Digi-Key; ComponentLink7URL: https://datasheet.ciiva.com/4689/sml-p1-471200-4689502.pdf?src-supplier=Mouser; ComponentLink7Description: https://datasheet.ciiva.com/4689/sml-p1-471200-4689502.pdf?src-supplier=Mouser; ComponentLink8URL: https://datasheet.ciiva.com/29281/157928-da-01-en-led-0402-gelb-gruen-sml-p11mt-t86-29281338.pdf?src-supplier=Conrad; ComponentLink8Description: https://datasheet.ciiva.com/29281/157928-da-01-en-led-0402-gelb-gruen-sml-p11mt-t86-29281338.pdf?src-supplier=Conrad; Supplier Part Number 1: 511-1652-1-ND
L1 = LQM21PN1R5MC0D: MURATA         LQM21PN1R5MC0D             Surface Mount High Frequency Inductor, LQM21PN Series, 1.5 H, 0805 [2012 Metric], Multilayer; Core Material: Ferrite; Max DC Current: 700mA; Tolerance: 20%; DC Resistance (DCR): 325mR; Test Frequency: 1MHz; Self Resonant Frequency: 70MHz; Shielding: Shielded; Manufacturer_Part_Number: LQM21PN1R5MC0D; Vendor: MuRata; Manufacturer_Name: MuRata; RefDes: RefDes; TYPE: TYPE; Value: Value; Supplier 1: Digi-Key; Manufacturer: Murata; Manufacturer Part Number: LQM21PN1R5MC0D; RoHS: Yes; Category: Fixed Inductors; Stock 1: 16348; Pricing 1: 1=0,29000, 10=0,25900, 100=0,17840, 500=0,15242, 1000=0,11675 (USD); Mount: Surface Mount; Case/Package: 0805; Case Code (Metric): 2012; Case Code (Imperial): 0805; Min Operating Temperature: -55°C; Max Operating Temperature: 125°C; Termination: SMD/SMT; DC Current: 700mA; Military Standard: Not; Inductance Tolerance: 20%; Packaging: Tape and Reel; Package Quantity: 4000; Current Rating: 700mA; Length: 2mm; Height: 0.5mm; Depth: 1.45mm; Height - Seated (Max): 0.022inch; Width: 0.049inch; Radiation Hardening: No; REACH SVHC: No SVHC; ComponentLink1URL: https://datasheet.ciiva.com/3867/337lqm21pn1r5mc023-3867733.pdf?src-supplier=Arrow; ComponentLink1Description: https://datasheet.ciiva.com/3867/337lqm21pn1r5mc023-3867733.pdf?src-supplier=Arrow; ComponentLink2URL: https://datasheet.ciiva.com/30489/0900766b81256150-30489029.pdf?src-supplier=RSComponents; ComponentLink2Description: https://datasheet.ciiva.com/30489/0900766b81256150-30489029.pdf?src-supplier=RSComponents; ComponentLink3URL: https://datasheet.ciiva.com/4955/product-4955595.pdf?src-supplier=Mouser; ComponentLink3Description: https://datasheet.ciiva.com/4955/product-4955595.pdf?src-supplier=Mouser; ComponentLink4URL: https://datasheet.ciiva.com/17278/l0075s0104lqm21p-c0-17278732.pdf?src-supplier=Avnet+Europe; ComponentLink4Description: https://datasheet.ciiva.com/17278/l0075s0104lqm21p-c0-17278732.pdf?src-supplier=Avnet+Europe; ComponentLink5URL: https://datasheet.ciiva.com/8509/l0075s0104lqm21p-c0-8509069.pdf?src-supplier=Avnet; ComponentLink5Description: https://datasheet.ciiva.com/8509/l0075s0104lqm21p-c0-8509069.pdf?src-supplier=Avnet; Supplier Part Number 1: 490-4993-1-ND
L2 = DFE18SANR47MG0L: FIXED IND 470NH 2.6A 54 MOHM SMD; Vendor: MuRata; Core Material: Metal; Tolerance: 20%; Saturation Current: 3.6A; Shielding: Shielded; DC Resistance (DCR): 54mR; Test Frequency: 1MHz; Manufacturer_Part_Number: DFE18SANR47MG0L; Manufacturer_Name: MuRata; RefDes: RefDes; TYPE: TYPE; Value: Value; Supplier 1: Digi-Key; Manufacturer: Murata; Manufacturer Part Number: DFE18SANR47MG0L; RoHS: No; Category: Fixed Inductors; Stock 1: 56519; Pricing 1: 1=0,55000, 10=0,48300, 100=0,34500, 500=0,28980, 1000=0,23460 (USD); Mount: Surface Mount; Case/Package: 0603; Case Code (Imperial): 0603; Case Code (Metric): 1608; Min Operating Temperature: -40°C; Max Operating Temperature: 85°C; Packaging: Tape and Reel; Current Rating: 2.6A; ComponentLink1URL: http://search.murata.co.jp/Ceramy/image/img/P02/JETE243A-0036.pdf?src-supplier=Digi-Key; ComponentLink1Description: http://search.murata.co.jp/Ceramy/image/img/P02/JETE243A-0036.pdf?src-supplier=Digi-Key; Supplier Part Number 1: 490-16581-1-ND
L3 L4 = CMP-0003306-1: Ferrite Bead, 60 ohm @ 100 MHz, 3 A, 0805; Manufacturer: Taiyo Yuden; Imax_A: 3A; DCR_ohm: 0.025; Value1: 0.025 ohm; ZTyp@100MHz_Ohm: 60; SizeArea_mm2: 2.5; SizeAreaWB_mm2: 6.75; SizeX_mm: 2; SizeY_mm: 1.25; SizeZ_mm: 1.45; CompType: Ferrite Bead; PartNumber: BKP2125HS600-T; Value2: 3A; MountType: SMT; PackageReference: 0805; Published: 2014-04-30; Publisher: Texas Instruments; LatestRevisionDate: 2017-03-09; ComponentLink1Description: Datasheet link; ComponentLink1URL: http://www.yuden.co.jp/productdata/catalog/en/mlci08_e.pdf; RoHS: Y; Supplier 1: Digi-Key; Supplier Part Number 1: 587-1932-1-ND; Supplier 2: Newark; Supplier Part Number 2: 30K5394 LF BKP2125HS600-T; Supplier 3: Mouser; Supplier Part Number 3: 963-BKP2125HS600-T; ValueDisplayed: 60 ohm
L5 = CMP-0003363-1: Ferrite Bead, 220 ohm @ 100 MHz, 2 A, 0805; Manufacturer: MuRata; Imax_A: 2A; DCR_ohm: 0.045; Value1: 0.045 ohm; ZTyp@100MHz_Ohm: 220; SizeArea_mm2: 2.5; SizeAreaWB_mm2: 6.75; SizeX_mm: 2; SizeY_mm: 1.25; SizeZ_mm: 1.45; CompType: Ferrite Bead; PartNumber: BLM21PG221SN1D; Value2: 2A; MountType: SMT; PackageReference: 0805; Published: 2014-04-30; Publisher: Texas Instruments; LatestRevisionDate: 2017-03-09; ComponentLink1Description: Datasheet link; ComponentLink1URL: http://search.murata.co.jp/Ceramy/image/img/PDF/ENG/L0110S0100BLM21P.pdf; RoHS: Y; Supplier 1: Digi-Key; Supplier Part Number 1: 490-1054-1-ND; Supplier 2: Newark; Supplier Part Number 2: 73M9167; Supplier 3: Mouser; Supplier Part Number 3: 81-BLM21P221SG; ValueDisplayed: 220 ohm
L6 = DFE18SANR24ME0L: FIXED IND 240NH 3.2A 36 MOHM SMD; Manufacturer: Murata; Core Material: Metal; Tolerance: 20%; Saturation Current: 4.2A; Shielding: Shielded; DC Resistance (DCR): 36mR; Test Frequency: 1MHz; Supplier 1: Digi-Key; Manufacturer Part Number: DFE18SANR24ME0L; RoHS: No; Category: Fixed Inductors; Stock 1: 517; Pricing 1: 1=0,55000, 10=0,48300, 100=0,34500, 500=0,28980, 1000=0,23460 (USD); Mount: Surface Mount; Case/Package: 0603; Case Code (Imperial): 0603; Case Code (Metric): 1608; Min Operating Temperature: -40°C; Max Operating Temperature: 85°C; Packaging: Tape and Reel; Current Rating: 3.2A; ComponentLink1URL: http://search.murata.co.jp/Ceramy/image/img/P02/JETE243A-0037.pdf?src-supplier=Digi-Key; ComponentLink1Description: http://search.murata.co.jp/Ceramy/image/img/P02/JETE243A-0037.pdf?src-supplier=Digi-Key; Supplier Part Number 1: 490-16578-1-ND
R = UCR006YVPFLR100: 100 mOhms Â±1% 0.1W, 1/10W Chip Resistor 0201 (0603 Metric) Current Sense Thick Film; MF: Rohm; Package: 0603 Rohm Semiconductor; SnapEDA_Link: https://www.snapeda.com/parts/UCR006YVPFLR100/Rohm/view-part/974809/?ref=snap; Mouser-Purchase-URL: https://snapeda.com/shop?store=Mouser&id=974809; Digi-Key_Part_Number: RHM1694-1-ND; DigiKey-Purchase-URL: https://snapeda.com/shop?store=DigiKey&id=974809; MP: UCR006YVPFLR100
R45 R46 = CRCW0402100KFKED: Res Thick Film 0402 100K Ohm 1% 1/16W 100ppm/C Molded SMD Paper T/R; Manufacturer: Vishay; Vendor: Vishay-Dale; Temperature Coefficient: 100ppm/°C; Power Rating: 63mW; Voltage Rating: 50V; Manufacturer_Part_Number: CRCW0402100KFKED; Manufacturer_Name: Vishay-Dale; RefDes: RefDes; TYPE: TYPE; Value: Value; Supplier 1: Farnell; Manufacturer Part Number: CRCW0402100KFKED; RoHS: Yes; Category: Chip SMD Resistors; Stock 1: 6820000; Pricing 1: 10000=0,00330 (EUR); Mount: Surface Mount; Case/Package: 0402; Number of Pins: 2; Weight: 2.3E-05oz; Contact Plating: Tin; Case Code (Metric): 1005; Case Code (Imperial): 0402; Min Operating Temperature: -55°C; Max Operating Temperature: 155°C; Tolerance: 1%; Composition: Thick Film; Termination: SMD/SMT; Number of Terminations: 2; Features: Automotive AEC-Q200; Max Power Dissipation: 63mW; Packaging: Tape and Reel; Package Quantity: 10000; Voltage Rating (DC): 50V; Military Standard: Not; Length: 1mm; Height: 0.35mm; Depth: 0.5mm; Width: 0.02inch; Radiation Hardening: No; Lead Free: Lead Free; REACH SVHC: Unknown; ComponentLink1URL: https://datasheet.ciiva.com/11810/0900766b80d98824-11810752.pdf?src-supplier=RSComponents; ComponentLink1Description: https://datasheet.ciiva.com/11810/0900766b80d98824-11810752.pdf?src-supplier=RSComponents; ComponentLink2URL: https://datasheet.ciiva.com/2463/dcrcwe3-2463064.pdf?src-supplier=Digi-Key; ComponentLink2Description: https://datasheet.ciiva.com/2463/dcrcwe3-2463064.pdf?src-supplier=Digi-Key; ComponentLink3URL: https://datasheet.ciiva.com/2463/dcrcwe3-2463065.pdf?src-supplier=Digi-Key; ComponentLink3Description: https://datasheet.ciiva.com/2463/dcrcwe3-2463065.pdf?src-supplier=Digi-Key; ComponentLink4URL: https://datasheet.ciiva.com/2463/dcrcwe3-2463066.pdf?src-supplier=Digi-Key; ComponentLink4Description: https://datasheet.ciiva.com/2463/dcrcwe3-2463066.pdf?src-supplier=Digi-Key; ComponentLink5URL: https://datasheet.ciiva.com/3255/dcrcwe3-3255948.pdf?src-supplier=Avnet; ComponentLink5Description: https://datasheet.ciiva.com/3255/dcrcwe3-3255948.pdf?src-supplier=Avnet; ComponentLink6URL: https://datasheet.ciiva.com/5546/dcrcwe3-109170-5546638.pdf?src-supplier=Mouser; ComponentLink6Description: https://datasheet.ciiva.com/5546/dcrcwe3-109170-5546638.pdf?src-supplier=Mouser; ComponentLink7URL: https://datasheet.ciiva.com/26316/fld-crcw-e3-data-en-26316630.pdf?src-supplier=Distrelec; ComponentLink7Description: https://datasheet.ciiva.com/26316/fld-crcw-e3-data-en-26316630.pdf?src-supplier=Distrelec; ComponentLink8URL: https://datasheet.ciiva.com/16776/70201119-16776281.pdf?src-supplier=Allied+Electronics; ComponentLink8Description: https://datasheet.ciiva.com/16776/70201119-16776281.pdf?src-supplier=Allied+Electronics; ComponentLink9URL: https://datasheet.ciiva.com/16941/dcrcwe3-16941129.pdf?src-supplier=Avnet+Europe; ComponentLink9Description: https://datasheet.ciiva.com/16941/dcrcwe3-16941129.pdf?src-supplier=Avnet+Europe; ComponentLink10URL: https://datasheet.ciiva.com/3255/dcrcwe3-3255947.pdf?src-supplier=Avnet; ComponentLink10Description: https://datasheet.ciiva.com/3255/dcrcwe3-3255947.pdf?src-supplier=Avnet; ComponentLink11URL: https://datasheet.ciiva.com/16208/dcrcwe3-16208508.pdf?src-supplier=Future+Electronics; ComponentLink11Description: https://datasheet.ciiva.com/16208/dcrcwe3-16208508.pdf?src-supplier=Future+Electronics; ComponentLink12URL: https://datasheet.ciiva.com/46441/1720486-46441598.pdf?src-supplier=Element14; ComponentLink12Description: https://datasheet.ciiva.com/46441/1720486-46441598.pdf?src-supplier=Element14; Supplier Part Number 1: 2121857
R74 R104 R106 = CMP-0026890-5: as R4-R6 on sheet OMODRI_EtherCAT_1; Supplier Part Number 2: 59M6710; Supplier 2: Newark; Supplier Part Number 3: 71-CRCW0402J-2.2K-E3; Supplier 3: Mouser; RoHS: E; Value1: 5%; MountType: SMT; Supplier 1: Digi-Key; PackageReference: 0402; Tolerance_%: 5%; Res_ohm: 2.2k; SizeArea_mm2: 0.5; CompType: Resistor; PartNumber: CRCW04022K20JNED; ComponentLink1Description: Datasheet link; Supplier Part Number 1: 541-2.2KJCT-ND; Technology: Thick Film; ComponentLink1URL: http://www.vishay.com/docs/20035/dcrcwe3.pdf
TP34 TP37 TP38 = CMP-0078143-2: TEST POINT.  No entry in BOM.; CompType: Testpoint; PackageReference: N/A; Manufacturer: N/A; PartNumber: N/A; Library Reference: TESTPOINT
U6 = LMZM23601V5SILR: 36-V, 1-A Step-Down DC-DC Power Module in 3.8-mm × 3-mm Package 10-uSiP -40 to 125; Manufacturer: Texas Instruments; Number of Outputs: 1; Min Input Voltage: 4V; Max Input Voltage: 36V; Voltage - Output 1: 5V; Max Output Current: 1A; Efficiency: 87%; PartNumber: LMZM23601V5SILR; RefDes: RefDes; Type: DEV; Value: Value; Manufacturer_Part_Number: LMZM23601V5SILR; Manufacturer_Name: Texas Instruments; Supplier 1: Digi-Key; Manufacturer Part Number: LMZM23601V5SILR; RoHS: No; Stock 1: 5; Pricing 1: 1=5,36000, 10=4,81700, 25=4,55400, 100=3,74440, 250=3,35984, 500=3,23840, 1000=2,69192 (USD); Mount: Surface Mount; Min Operating Temperature: -40°C; Max Operating Temperature: 125°C; Features: UVLO,OCP,SCP; Packaging: Cut Tape; ComponentLink1URL: http://www.ti.com/lit/ds/symlink/lmzm23601.pdf?src-supplier=Digi-Key; ComponentLink1Description: http://www.ti.com/lit/ds/symlink/lmzm23601.pdf?src-supplier=Digi-Key; Supplier Part Number 1: 296-LMZM23601V5SILRCT-ND
U14 = TPS6208833YFPR: 3A STEP-DOWN CONVERTER - FIXED 3; Manufacturer: Texas Instruments; Output Configuration: Positive; Number of Outputs: 1; Min Input Voltage: 2.4V; Max Input Voltage: 5.5V; Min Output Voltage: 3.3V; Switching Frequency: 4MHz; Synchronous Rectifier: Yes; PartNumber: TPS6208833YFPR; RefDes: RefDes; TYPE: TYPE; Value: Value; Manufacturer_Part_Number: TPS6208833YFPR; Manufacturer_Name: Texas Instruments; Supplier 1: Arrow; Manufacturer Part Number: TPS6208833YFPR; RoHS: No; Stock 1: 27000; Pricing 1: 3000=0,70140, 6000=0,67110, 9000=0,64020 (USD); Mount: Surface Mount; Min Operating Temperature: -40°C; Max Operating Temperature: 125°C; Output Type: Fixed; Packaging: Tape and Reel; Output Current: 3A; ComponentLink1URL: http://www.ti.com/lit/ds/symlink/tps62088.pdf?src-supplier=Digi-Key; ComponentLink1Description: http://www.ti.com/lit/ds/symlink/tps62088.pdf?src-supplier=Digi-Key; Supplier Part Number 1: TPS6208833YFPR
U15 = CMP-0081777-3: TMS320F28388DZWTS, ZWT0337A (NFBGA-337); Manufacturer: Texas Instruments; SizeAreaWB_mm2: 324; SizeArea_mm2: 256; AEC Qualified: N; AEC Category: Q200; SizeZ_mm: 1.4; SizeY_mm: 16; CompType: IC; ComponentLink1Description: Datasheet Link; ComponentLink2Description: Product Folder; PackageReference: ZWT0337A; PartNumber: TMS320F28388DZWTS; PackageDescription: NFBGA-337; ComponentLink2URL: http://www.ti.com/product/tms320f28388d; Alternate Manufacturer: Texas Instruments; ComponentLink3URL: http://www.ti.com/product/tms320f28388d/datasheet; ComponentLink1URL: http://www.ti.com/lit/ds/symlink/tms320f28388d.pdf; MountType: SMT; ComponentLink3Description: Online Datasheet; SizeX_mm: 16
U31 = TPS6208812YFPR: 3A STEP-DOWN CONVERTER - FIXED 3; Manufacturer: Texas Instruments; Output Configuration: Positive; Number of Outputs: 1; Min Input Voltage: 2.4V; Max Input Voltage: 5.5V; Min Output Voltage: 1.2V; Switching Frequency: 4MHz; Synchronous Rectifier: Yes; PartNumber: TPS6208812YFPR; RefDes: RefDes; TYPE: TYPE; Value: Value; Manufacturer_Part_Number: TPS6208812YFPR; Manufacturer_Name: Texas Instruments; Supplier 1: Avnet; Manufacturer Part Number: TPS6208812YFPR; RoHS: No; Pricing 1: 3000=0,79050, 6000=0,75229, 12000=0,72718, 18000=0,70278, 30000=0,68338 (USD); Mount: Surface Mount; Min Operating Temperature: -40°C; Max Operating Temperature: 125°C; Output Type: Fixed; Packaging: Tape and Reel; Output Current: 3A; ComponentLink1URL: http://www.ti.com/lit/ds/symlink/tps62088.pdf?src-supplier=Digi-Key; ComponentLink1Description: http://www.ti.com/lit/ds/symlink/tps62088.pdf?src-supplier=Digi-Key; Supplier Part Number 1: TPS6208812YFPR